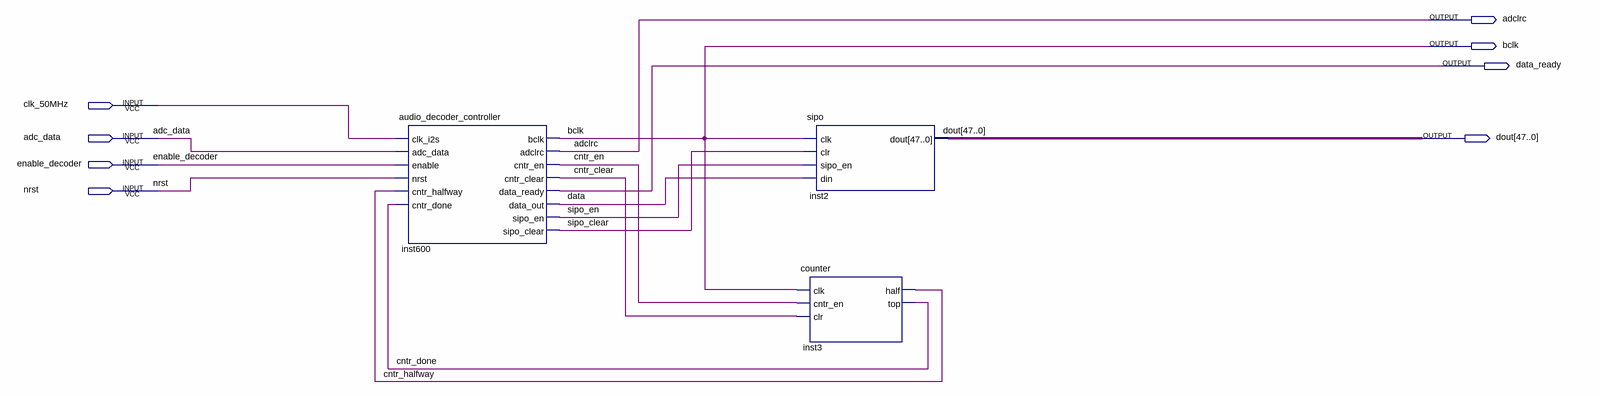
[diagram p0: schematic sheet]
// Quartus schematic audio_decoder.bdf as structural Verilog: 3 symbols, 8 pins
module audio_decoder (
  input  clk_50MHz,
  input  adc_data,
  input  enable_decoder,
  input  nrst,
  output adclrc,
  output bclk,
  output data_ready,
  output [47:0] dout
);

  wire cntr_clear, cntr_done, cntr_en, cntr_halfway, data, sipo_clear, sipo_en;

  audio_decoder_controller inst600 (
    .clk_i2s(clk_50MHz), .adc_data(adc_data), .enable(enable_decoder), .nrst(nrst),
    .cntr_halfway(cntr_halfway), .cntr_done(cntr_done), .bclk(bclk), .adclrc(adclrc), .cntr_en(cntr_en),
    .cntr_clear(cntr_clear), .data_ready(data_ready), .data_out(data), .sipo_en(sipo_en),
    .sipo_clear(sipo_clear));
  sipo inst2 (.clk(bclk), .clr(sipo_clear), .sipo_en(sipo_en), .din(data), .dout(dout));
  counter inst3 (.clk(bclk), .cntr_en(cntr_en), .clr(cntr_clear), .half(cntr_halfway), .top(cntr_done));
endmodule
